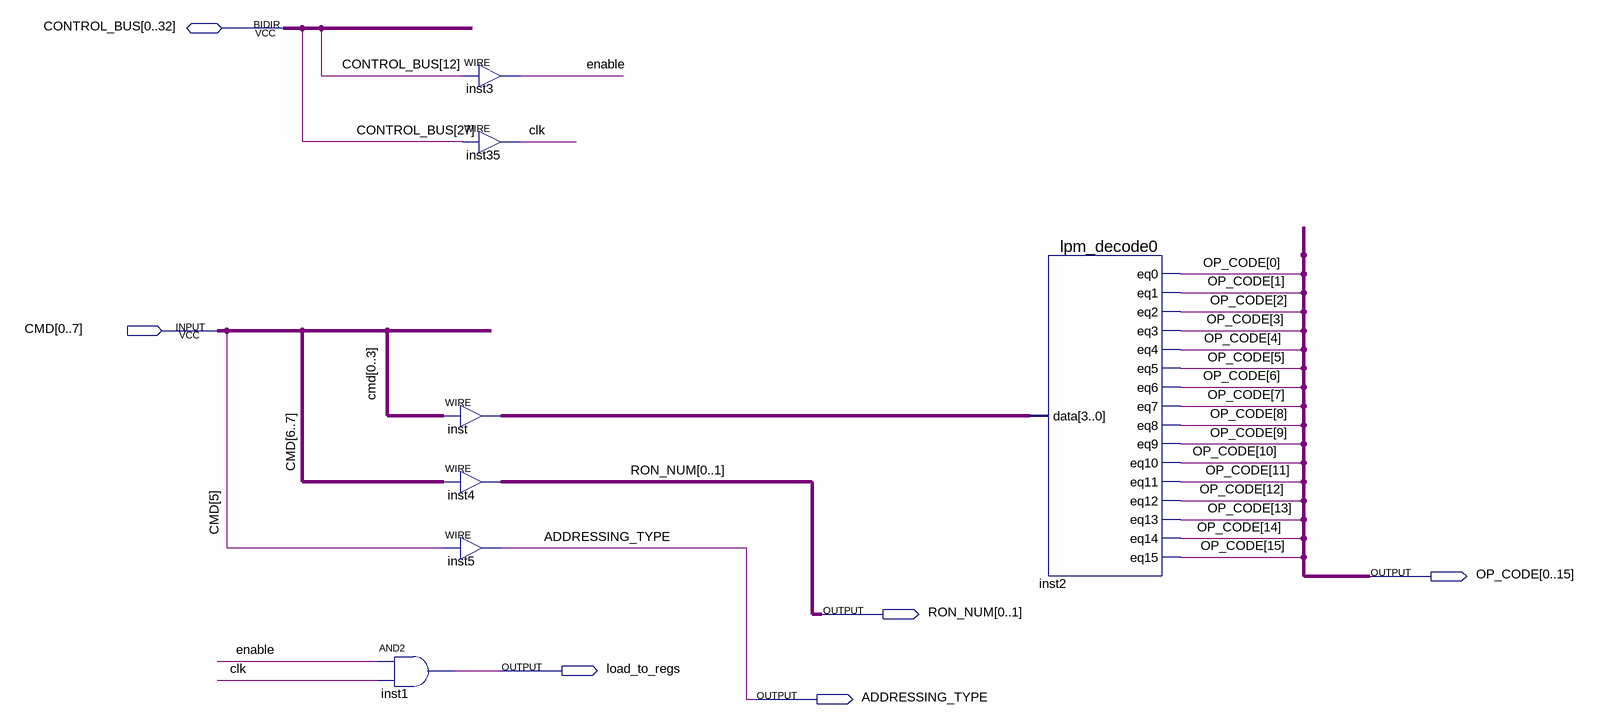
[diagram p0: schematic sheet]
// Quartus schematic PARCER.bdf as structural Verilog: 7 symbols, 6 pins
module PARCER (
  input  [0:7] CMD,
  inout  [0:32] CONTROL_BUS,
  output [0:15] OP_CODE,
  output [0:1] RON_NUM,
  output load_to_regs,
  output ADDRESSING_TYPE
);

  wire clk, enable;
  wire [3:0] inst_out;

  and inst1 (load_to_regs, enable, clk);
  assign inst_out = CMD[0:3];  // WIRE inst
  assign RON_NUM = CMD[6:7];  // WIRE inst4
  assign ADDRESSING_TYPE = CMD[5];  // WIRE inst5
  assign enable = CONTROL_BUS[12];  // WIRE inst3
  assign clk = CONTROL_BUS[27];  // WIRE inst35
  lpm_decode0 inst2 (
    .data(inst_out), .eq0(OP_CODE[0]), .eq1(OP_CODE[1]), .eq2(OP_CODE[2]), .eq3(OP_CODE[3]),
    .eq4(OP_CODE[4]), .eq5(OP_CODE[5]), .eq6(OP_CODE[6]), .eq7(OP_CODE[7]), .eq8(OP_CODE[8]),
    .eq9(OP_CODE[9]), .eq10(OP_CODE[10]), .eq11(OP_CODE[11]), .eq12(OP_CODE[12]), .eq13(OP_CODE[13]),
    .eq14(OP_CODE[14]), .eq15(OP_CODE[15]));
endmodule
